# Altium schematic sheet Sheet1.SchDoc
size A2; SheetNumber: 1; SheetTotal: 1
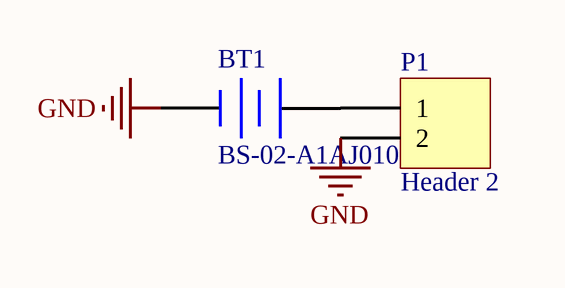
[diagram p0: Sheet1.SchDoc]

## Parts
BT1  BS-02-A1AJ010  [BS-02-A1AJ010]
P1  Header 2  [2x2.0mm_smt]

## Nets
GND: BT1.2(-) P1.2
NetBT1_1: BT1.1(+) P1.1

## Library data of the parts
BT1 = Battery: Multicell Battery; Published: 24-Mar-1999; LatestRevisionDate: 17-Jul-2002; LatestRevisionNote: Re-released for DXP Platform.; PackageReference: BAT-2; Publisher: Altium Limited
P1 = Header 2: Header, 2-Pin; LatestRevisionDate: 17-Jul-2002; LatestRevisionNote: Re-released for DXP Platform.; Publisher: Altium Limited